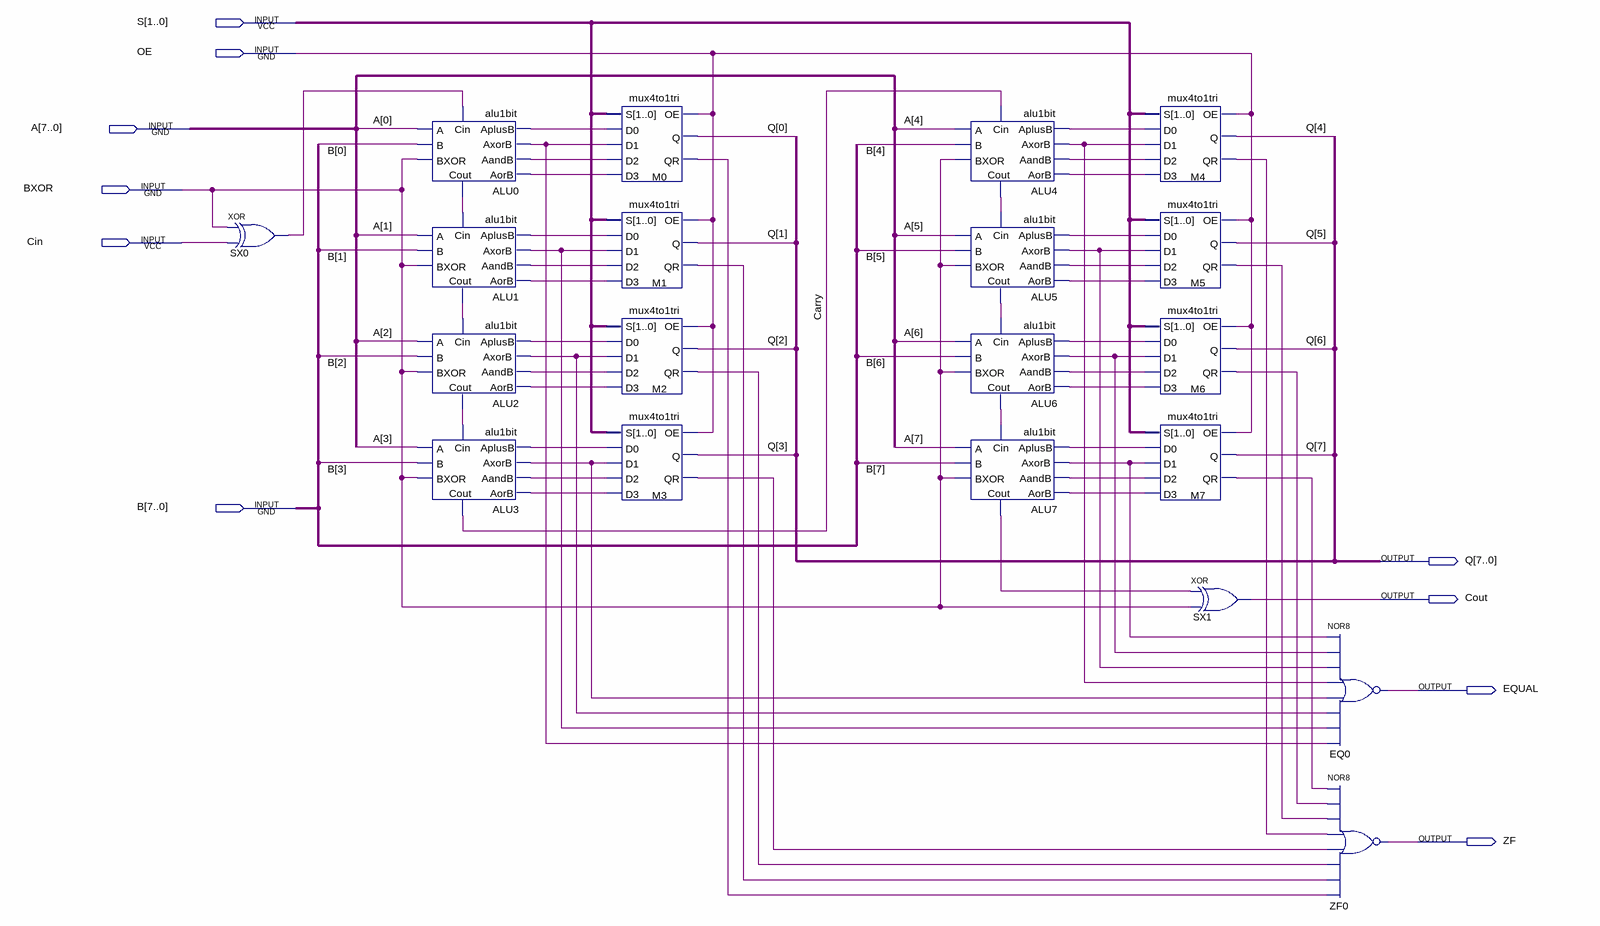
[diagram p0: schematic sheet]
// Quartus schematic alu8bit.bdf as structural Verilog: 20 symbols, 10 pins
module alu8bit (
  input  [1:0] S,
  input  OE,
  input  [7:0] A,
  input  BXOR,
  input  Cin,
  input  [7:0] B,
  output [7:0] Q,
  output Cout,
  output EQUAL,
  output ZF
);

  wire ALU0_aandb, ALU0_aorb, ALU0_aplusb, ALU0_axorb, ALU0_cout, ALU1_aandb, ALU1_aorb, ALU1_aplusb,
       ALU1_axorb, ALU1_cout, ALU2_aandb, ALU2_aorb, ALU2_aplusb, ALU2_axorb, ALU2_cout, ALU3_aandb,
       ALU3_aorb, ALU3_aplusb, ALU3_axorb, ALU4_aandb, ALU4_aorb, ALU4_aplusb, ALU4_axorb, ALU4_cout,
       ALU5_aandb, ALU5_aorb, ALU5_aplusb, ALU5_axorb, ALU5_cout, ALU6_aandb, ALU6_aorb, ALU6_aplusb,
       ALU6_axorb, ALU6_cout, ALU7_aandb, ALU7_aorb, ALU7_aplusb, ALU7_axorb, ALU7_cout, Carry, M0_qr, M1_qr,
       M2_qr, M3_qr, M4_qr, M5_qr, M6_qr, M7_qr, SX0_out;

  xor SX0 (SX0_out, BXOR, Cin);
  alu1bit ALU0 (
    .Cin(SX0_out), .A(A[0]), .BXOR(BXOR), .B(B[0]), .Cout(ALU0_cout), .AplusB(ALU0_aplusb),
    .AxorB(ALU0_axorb), .AandB(ALU0_aandb), .AorB(ALU0_aorb));
  alu1bit ALU1 (
    .Cin(ALU0_cout), .A(A[1]), .BXOR(BXOR), .B(B[1]), .Cout(ALU1_cout), .AplusB(ALU1_aplusb),
    .AxorB(ALU1_axorb), .AandB(ALU1_aandb), .AorB(ALU1_aorb));
  alu1bit ALU2 (
    .Cin(ALU1_cout), .A(A[2]), .BXOR(BXOR), .B(B[2]), .Cout(ALU2_cout), .AplusB(ALU2_aplusb),
    .AxorB(ALU2_axorb), .AandB(ALU2_aandb), .AorB(ALU2_aorb));
  alu1bit ALU3 (
    .Cin(ALU2_cout), .A(A[3]), .BXOR(BXOR), .B(B[3]), .Cout(Carry), .AplusB(ALU3_aplusb), .AxorB(ALU3_axorb),
    .AandB(ALU3_aandb), .AorB(ALU3_aorb));
  mux4to1tri M0 (
    .S(S), .OE(OE), .D3(ALU0_aorb), .D2(ALU0_aandb), .D1(ALU0_axorb), .D0(ALU0_aplusb), .Q(Q[0]), .QR(M0_qr));
  mux4to1tri M1 (
    .S(S), .OE(OE), .D3(ALU1_aorb), .D2(ALU1_aandb), .D1(ALU1_axorb), .D0(ALU1_aplusb), .Q(Q[1]), .QR(M1_qr));
  mux4to1tri M2 (
    .S(S), .OE(OE), .D3(ALU2_aorb), .D2(ALU2_aandb), .D1(ALU2_axorb), .D0(ALU2_aplusb), .Q(Q[2]), .QR(M2_qr));
  mux4to1tri M3 (
    .S(S), .OE(OE), .D3(ALU3_aorb), .D2(ALU3_aandb), .D1(ALU3_axorb), .D0(ALU3_aplusb), .Q(Q[3]), .QR(M3_qr));
  alu1bit ALU4 (
    .Cin(Carry), .A(A[4]), .BXOR(BXOR), .B(B[4]), .Cout(ALU4_cout), .AplusB(ALU4_aplusb), .AxorB(ALU4_axorb),
    .AandB(ALU4_aandb), .AorB(ALU4_aorb));
  alu1bit ALU5 (
    .Cin(ALU4_cout), .A(A[5]), .BXOR(BXOR), .B(B[5]), .Cout(ALU5_cout), .AplusB(ALU5_aplusb),
    .AxorB(ALU5_axorb), .AandB(ALU5_aandb), .AorB(ALU5_aorb));
  alu1bit ALU6 (
    .Cin(ALU5_cout), .A(A[6]), .BXOR(BXOR), .B(B[6]), .Cout(ALU6_cout), .AplusB(ALU6_aplusb),
    .AxorB(ALU6_axorb), .AandB(ALU6_aandb), .AorB(ALU6_aorb));
  alu1bit ALU7 (
    .Cin(ALU6_cout), .A(A[7]), .BXOR(BXOR), .B(B[7]), .Cout(ALU7_cout), .AplusB(ALU7_aplusb),
    .AxorB(ALU7_axorb), .AandB(ALU7_aandb), .AorB(ALU7_aorb));
  mux4to1tri M4 (
    .S(S), .OE(OE), .D3(ALU4_aorb), .D2(ALU4_aandb), .D1(ALU4_axorb), .D0(ALU4_aplusb), .Q(Q[4]), .QR(M4_qr));
  mux4to1tri M5 (
    .S(S), .OE(OE), .D3(ALU5_aorb), .D2(ALU5_aandb), .D1(ALU5_axorb), .D0(ALU5_aplusb), .Q(Q[5]), .QR(M5_qr));
  mux4to1tri M6 (
    .S(S), .OE(OE), .D3(ALU6_aorb), .D2(ALU6_aandb), .D1(ALU6_axorb), .D0(ALU6_aplusb), .Q(Q[6]), .QR(M6_qr));
  mux4to1tri M7 (
    .S(S), .OE(OE), .D3(ALU7_aorb), .D2(ALU7_aandb), .D1(ALU7_axorb), .D0(ALU7_aplusb), .Q(Q[7]), .QR(M7_qr));
  xor SX1 (Cout, ALU7_cout, BXOR);
  nor EQ0 (EQUAL, ALU7_axorb, ALU6_axorb, ALU5_axorb, ALU4_axorb, ALU3_axorb, ALU2_axorb, ALU1_axorb, ALU0_axorb);
  nor ZF0 (ZF, M7_qr, M6_qr, M5_qr, M4_qr, M3_qr, M2_qr, M1_qr, M0_qr);
endmodule
